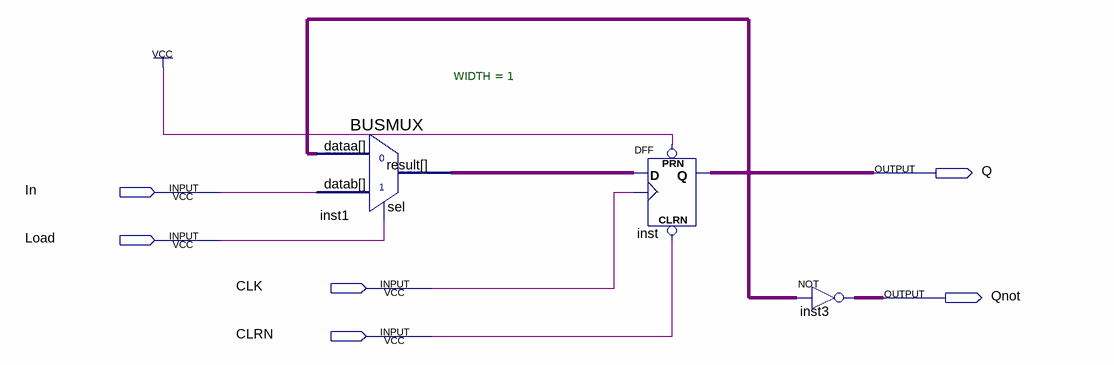
[diagram p0: schematic sheet]
// Quartus schematic Register.bdf as structural Verilog: 3 symbols, 6 pins
module Register (
  input  In,
  input  Load,
  input  CLK,
  input  CLRN,
  output Q,
  output Qnot
);

  wire inst1_result;

  BUSMUX #(.WIDTH(1)) inst1 (.datab(In), .sel(Load), .dataa(Q), .result(inst1_result));
  DFF inst (.CLRN(CLRN), .CLK(CLK), .D(inst1_result), .PRN(1'b1), .Q(Q));
  not inst3 (Qnot, Q);
endmodule
